# Altium schematic sheet device-pump.SchDoc
size 297 x 209 mm
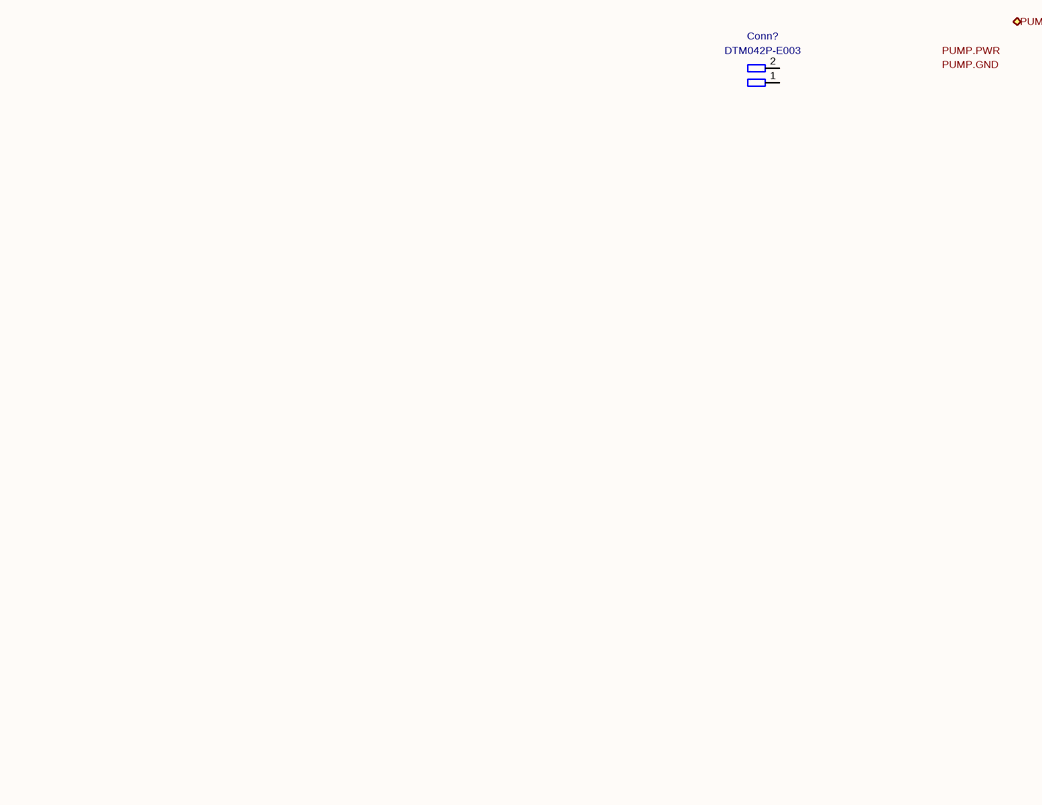
[diagram p0: device-pump.SchDoc]

## Parts
Conn?  P/N: DTM042P-E003  (hidden comment: Deutsch_DTM_2P_Pin)

## Ports
PUMP (bidir)

## Nets

Not connected (* = marked no-connect by the designer): Conn? 1 2

## Notes on the sheet
- Labels drawn without touching a wire or pin: PUMP.GND, PUMP.PWR
- 1
- 2
- 3
- 4
- 5
- 6
- A
- B
- C
- D
- Title: DEVICE - PUMP
- File: device-pump.kicad_sch
- Sheet: /
- KiCad E.D.A.  kicad (5.1.4)-1
- Size: A4
- Date:
- Rev:
- Id: 1/1

## Library data of the parts
Conn? = Deutsch_DTM_2P_Pin: Value: Deutsch_DTM_2P_Pin